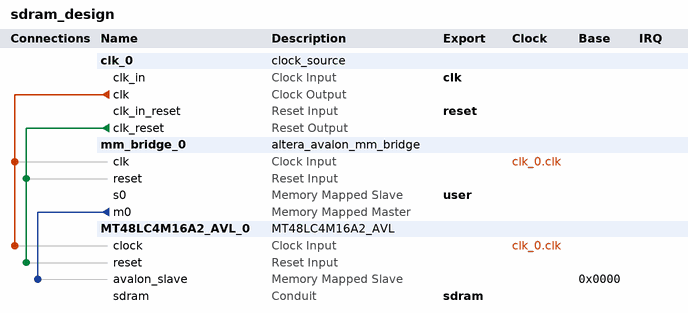
[diagram p0: system contents]
# Platform Designer (Qsys) system sdram_design, MAX 10 10M50SAE144C8G
# Parameters at their usual value, and those the tool derives, are not listed.
package require -exact qsys 18.0
create_system sdram_design
set_project_property DEVICE_FAMILY {MAX 10}
set_project_property DEVICE 10M50SAE144C8G

add_instance clk_0 clock_source 18.0
set_instance_parameter_value clk_0 clockFrequency 100000000

add_instance mm_bridge_0 altera_avalon_mm_bridge 18.0
set_instance_parameter_value mm_bridge_0 ADDRESS_UNITS WORDS
set_instance_parameter_value mm_bridge_0 ADDRESS_WIDTH 22
set_instance_parameter_value mm_bridge_0 DATA_WIDTH 16
set_instance_parameter_value mm_bridge_0 MAX_BURST_SIZE 256
set_instance_parameter_value mm_bridge_0 MAX_PENDING_RESPONSES 64
set_instance_parameter_value mm_bridge_0 USE_AUTO_ADDRESS_WIDTH 0

add_instance MT48LC4M16A2_AVL_0 MT48LC4M16A2_AVL 1.0
set_instance_parameter_value MT48LC4M16A2_AVL_0 ACTIVE_READ_WRITE 2
set_instance_parameter_value MT48LC4M16A2_AVL_0 LOAD_MODE_REGISTER 3
set_instance_parameter_value MT48LC4M16A2_AVL_0 PRECHARGE_COMMAND_PERIOD 2
set_instance_parameter_value MT48LC4M16A2_AVL_0 REFRESH_PERIOD 6400000
set_instance_parameter_value MT48LC4M16A2_AVL_0 WRITE_RECOVERY_TIME 2

# connections
add_connection clk_0.clk mm_bridge_0.clk clock
add_connection clk_0.clk MT48LC4M16A2_AVL_0.clock clock
add_connection clk_0.clk_reset mm_bridge_0.reset reset
add_connection clk_0.clk_reset MT48LC4M16A2_AVL_0.reset reset
add_connection mm_bridge_0.m0 MT48LC4M16A2_AVL_0.avalon_slave avalon
set_connection_parameter_value mm_bridge_0.m0/MT48LC4M16A2_AVL_0.avalon_slave baseAddress 0x0000

# exported interfaces
add_interface clk clock sink
set_interface_property clk EXPORT_OF clk_0.clk_in
add_interface reset reset sink
set_interface_property reset EXPORT_OF clk_0.clk_in_reset
add_interface sdram conduit end
set_interface_property sdram EXPORT_OF MT48LC4M16A2_AVL_0.sdram
add_interface user avalon slave
set_interface_property user EXPORT_OF mm_bridge_0.s0

set_interconnect_requirement {$system} qsys_mm.clockCrossingAdapter HANDSHAKE
set_interconnect_requirement {$system} qsys_mm.enableEccProtection FALSE
set_interconnect_requirement {$system} qsys_mm.insertDefaultSlave FALSE
set_interconnect_requirement {$system} qsys_mm.maxAdditionalLatency 1

save_system sdram_design.qsys
